# EasyEDA Pro project ProDocument_Affordable_2023-07-23.epro

# Schematic Schematic2_1
Create Date: 2023-07-10; Page Name: P1; Project Name: 39CASTIC; Schematic Name: Schematic2_1; Update Date: 2023-07-10; Add into BOM: yes; Company: 深圳嘉立创科技发展有限公司; Convert to PCB: yes; Drawed: 嘉立创EDA; Page Size: A3; Part Number: JLCPCB-001; Reviewed: 嘉立创EDA; Version: V0.1
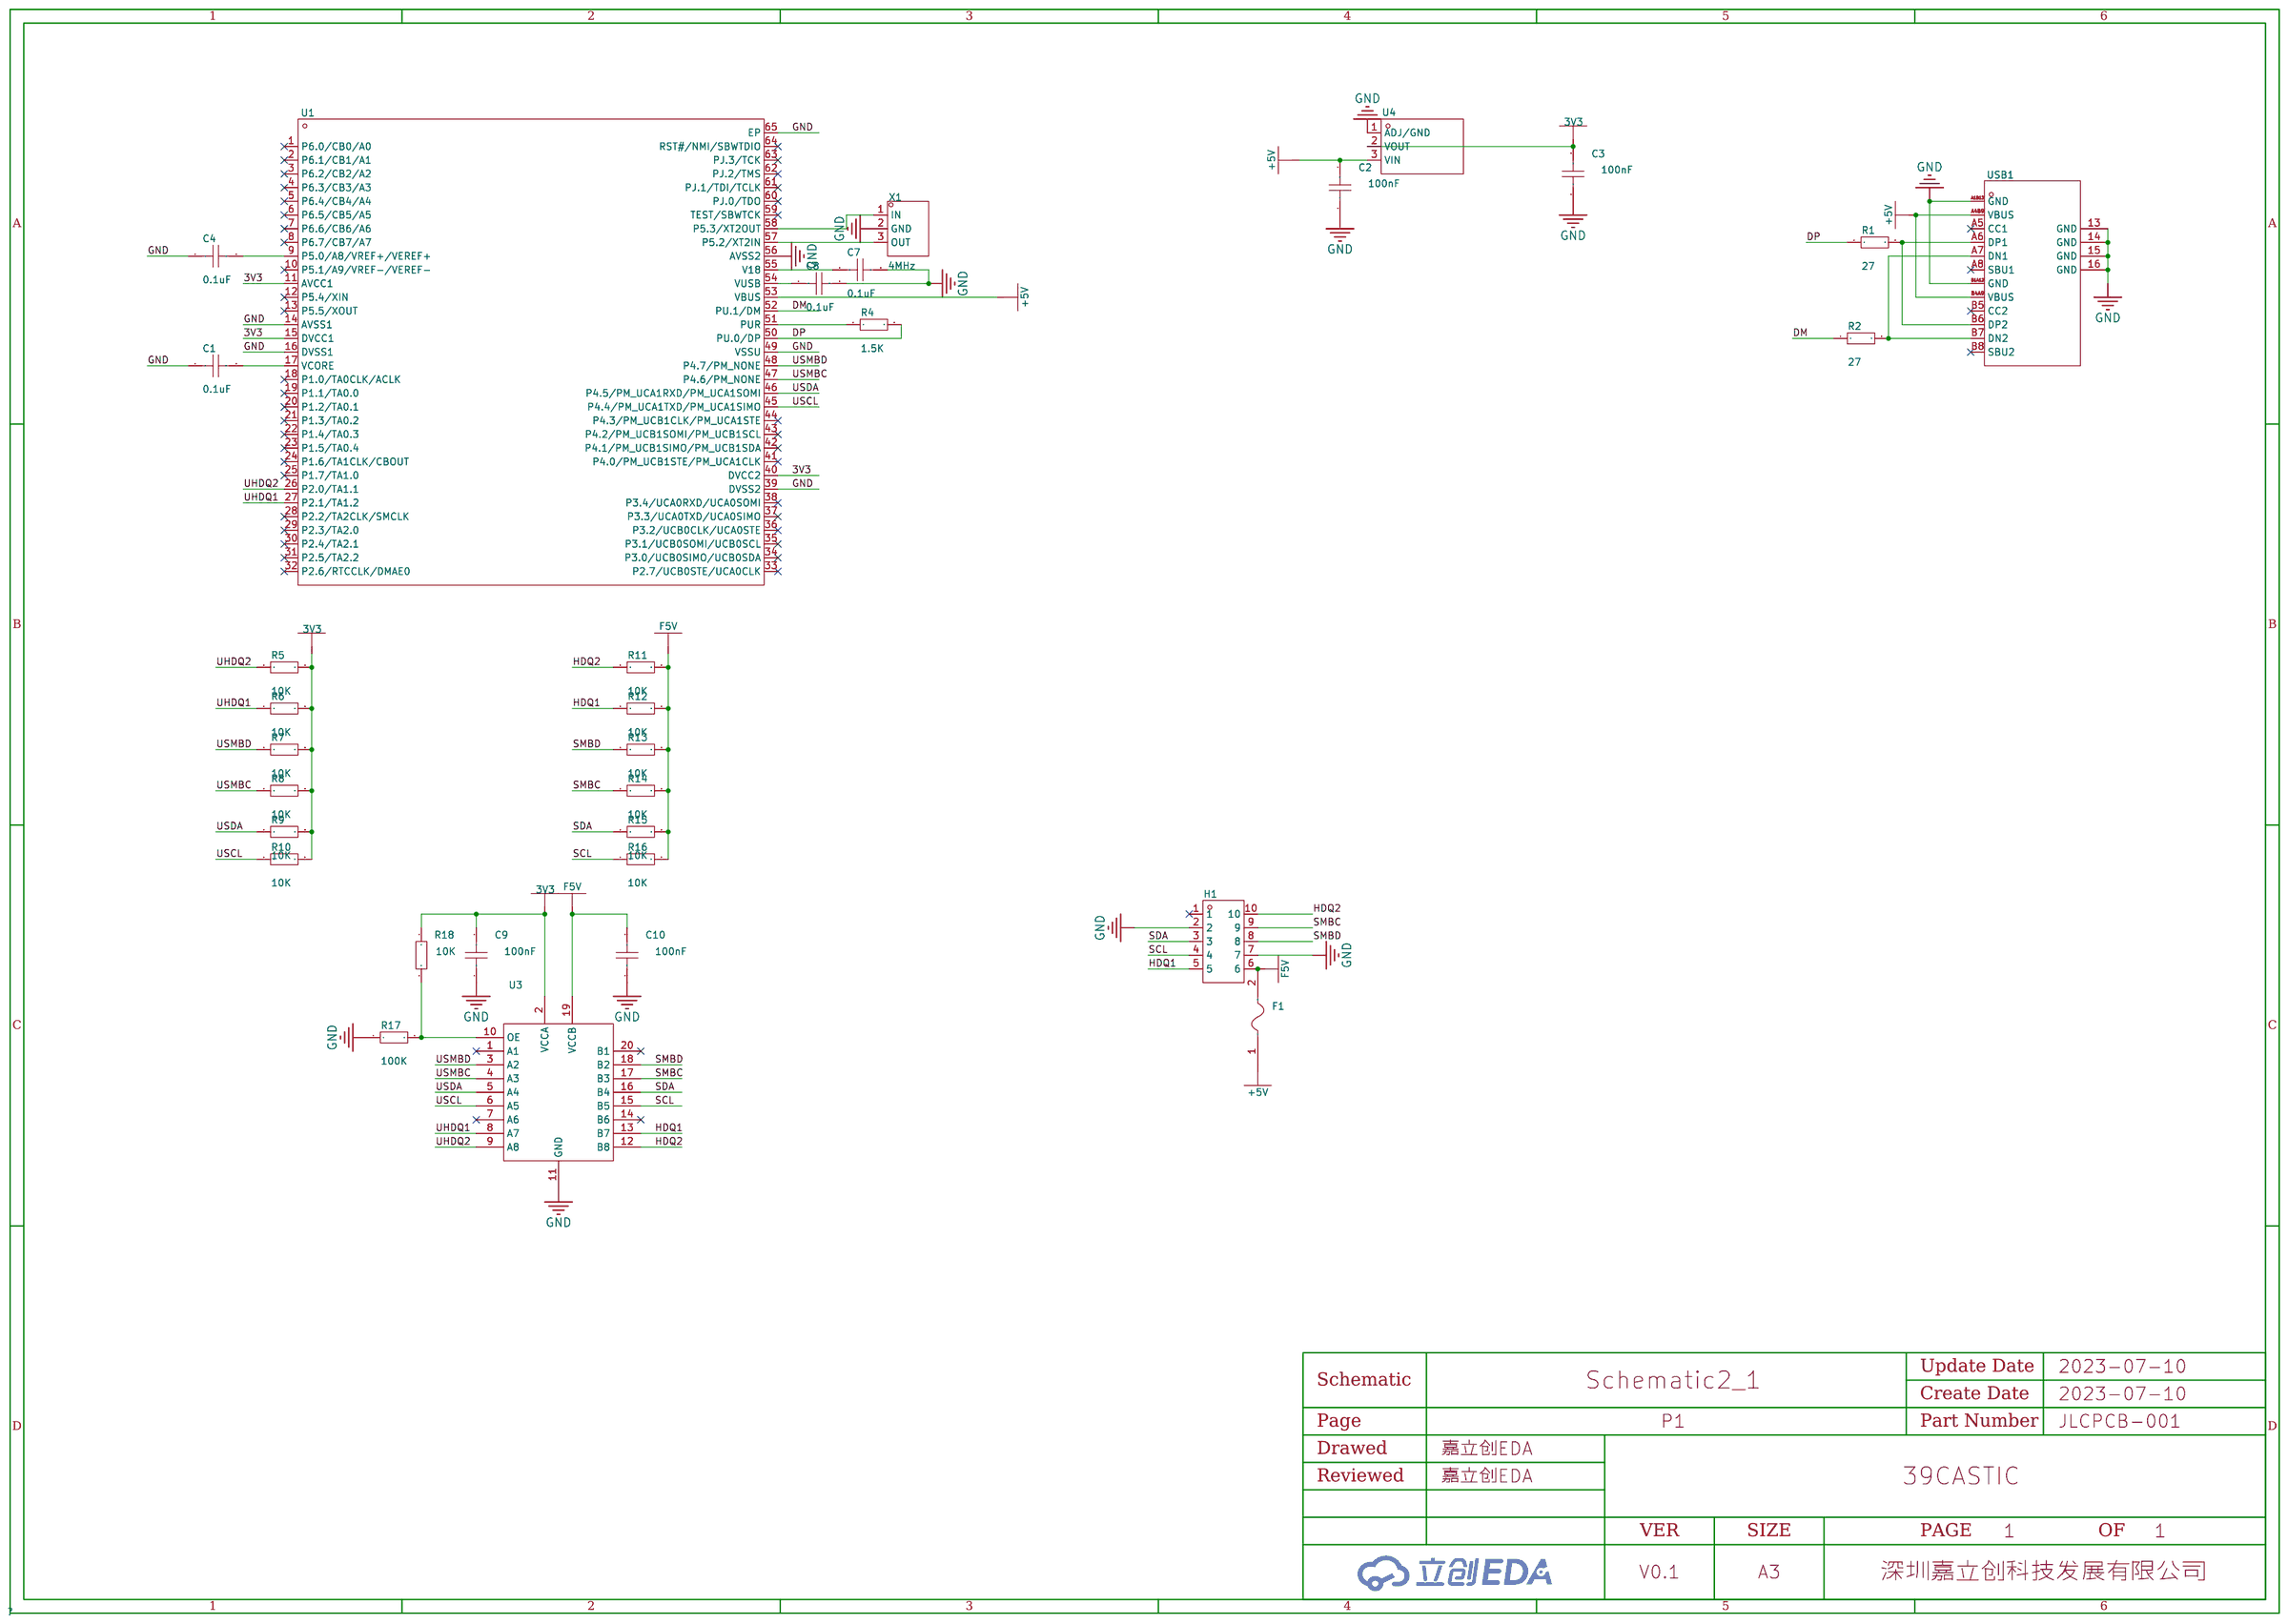
[diagram p0: schematic sheet]

## Parts
C1  0.1uF  [C0603_1]
C2  100nF  [C0603_1]
C3  100nF  [C0603_1]
C4  0.1uF  [C0603_1]
C7  0.1uF  [C0603_1]
C8  0.1uF  [C0603_1]
C9  100nF  [C0603_1]
C10  100nF  [C0603_1]
F1  -  [F0805]
H1  2*5p夹板_2.54mm  [2*5P_夹板_2.54MM]
R1  27  [R0603_1]
R2  27  [R0603_1]
R4  1.5K  [R0603_1]
R5  10K  [R0603_1]
R6  10K  [R0603_1]
R7  10K  [R0603_1]
R8  10K  [R0603_1]
R9  10K  [R0603_1]
R10  10K  [R0603_1]
R11  10K  [R0603_1]
R12  10K  [R0603_1]
R13  10K  [R0603_1]
R14  10K  [R0603_1]
R15  10K  [R0603_1]
R16  10K  [R0603_1]
R17  100K  [R0603_1]
R18  10K  [R0603_1]
U1  -  [QFN-64_L9.0-W9.0-P0.50-BL-EP4.3]
U3  -  [TSSOP-20_L6.5-W4.4-P0.65-LS6.4-BL]
U4  -  [SOT-89-3_L4.5-W2.5-P1.50-LS4.2-BR]
USB1  -  [USB-C-SMD_TYPEC-304-BCP16]
X1  4MHz  [OSC-SMD_3P-L4.5-W2.0]

## Library data of the parts
C1-C4 C7-C10 = CAP_604: 容值:100nF;精度:±10%;额定电压:50V;温度系数:X7R;; Supplier Footprint: 0603
F1 = MF-PSMF050X-2: 最大电压:6V;最大电流:40A;保持电流:500mA;跳闸电流:1A;; LCSC Part Name: 0.5A 6V 自恢复保险丝; Supplier Part: C116170; Manufacturer: BOURNS; Supplier Footprint: 0805; JLCPCB Part Class: Extended Part; Datasheet: https://atta.szlcsc.com/upload/public/pdf/source/20170704/1499151352150.pdf; Supplier: LCSC; Operating Voltage (Max): 6V; Current Rating (Max): 40A; Hold Current: 500mA; Trip Current: 1A
H1 = 2*5p夹板_2.54mm: Pin Type: IN
R1 R2 R4-R18 = Res_604: Supplier Footprint: 0603
U1 = MSP430F5528IRGCR: CPU位数:16-Bit;CPU内核:CPUXV2;主频（MAX):25MHz;工作电压:1.8V ~ 3.6V;; Supplier Part: C179685; Manufacturer: TI(德州仪器); Supplier Footprint: QFN-64_9x9x05P; JLCPCB Part Class: Extended Part; Datasheet: https://atta.szlcsc.com/upload/public/pdf/source/20180202/C179685_15175649480981336386.pdf; Supplier: LCSC; Core Size: 16-Bit; Core Processor: CPUXV2; Speed: 25MHz; Voltage - Supply (Vcc/Vdd): 1.8V ~ 3.6V; RAM Size: 10KB; Number of I/O: 47; A/D: 12x12bit; PWM: 3; I2C（SMBUS/PMBUS）: 2; USB Device: 1; USB Host/OTG: 1; Features: IrDA,LIN,SCI
U3 = TXS0108EPWR: 转换器类型:电压电平;通道类型:双向;电路数:1;每个电路通道数:8;工作电压(VCCA):1.4V~3.6V;工作电压(VCCB):1.65V~5.5V;输入信号:-;输出信号:-;输出类型:开路漏极，推挽式;数据速率:60Mbps;工作温度:-40~+85;特性:自动方向检测;; Supplier Part: C17206; Manufacturer: TI(德州仪器); Supplier Footprint: TSSOP-20; JLCPCB Part Class: Extended Part; Datasheet: https://atta.szlcsc.com/upload/public/pdf/source/20140704/1457707111315.pdf; Supplier: LCSC; Translator Type: 电压电平; Channel Type: 双向; Number of Circuits: 1; Channels per Circuit: 8; Supply Voltage (VCCA): 1.4V~3.6V; Supply Voltage (VCCB): 1.65V~5.5V; Output Type: 开路漏极，推挽式; Data Rate: 60Mbps; Operating Temperature: -40~+85; Features: 自动方向检测
U4 = AMS1117-5.0: 输出类型:-;; Supplier Part: C880753; Manufacturer: Slkor(萨科微); Supplier Footprint: SOT-89; JLCPCB Part Class: Extended Part; Datasheet: https://atta.szlcsc.com/upload/public/pdf/source/20190906/C426566_95BE246DE70C248781207323626ADB09.pdf; Supplier: LCSC
USB1 = TYPEC-304-BCP16: 连接器类型:Type-C;标准:USB 3.1;公母:母座;触点数量:16.0;端口数量:1;安装方式:卧贴;额定电流 - 电源:3A;工作温度范围:-25~+85;焊接温度(最大值):260;; Supplier Part: C720629; Manufacturer: XUNPU(讯普); Supplier Footprint: SMD; JLCPCB Part Class: Extended Part; Datasheet: https://atta.szlcsc.com/upload/public/pdf/source/20211022/DACD6552F639E9483017DE6DC0E61150.pdf; Supplier: LCSC; Connector Type: Type-C; Standard: USB 3.1; Gender: 母座; Number of Contacts: 16.0; Number of Ports: 1; Mounting Sytle: 卧贴; Current Rating - Power (Max): 3A; Operating Temperature Range: -25~+85; Welding Temperature (Max): 260
X1 = CSTCR4M00G55B-R0: 频率:4MHz;频率容差:±0.5%;内藏负载电容:39pF;谐振阻抗:60Ω;; LCSC Part Name: 4MHz ±0.5% 39pF; Supplier Part: C167451; Manufacturer: muRata(村田); Supplier Footprint: SMD4520-3P; JLCPCB Part Class: Extended Part; Datasheet: https://atta.szlcsc.com/upload/public/pdf/source/20180329/C167451_1EABA10DA012BB465BD4ADA114EBBA6C.pdf; Supplier: LCSC; Frequency Stability: ±0.15%; Frequency Tolerance: ±0.5%; Built-in Load Capacitance: 39pF; Resonant Impedance: 60Ω; Operating Temperature: -40~+125

## Nets
3V3: C3.2 C9.2 R5.2 R6.2 R7.2 R8.2 R9.2 R10.2 R18.2 U1.11(AVCC1) U1.15(DVCC1) U1.40(DVCC2) U3.2(VCCA) U4.2(VOUT)
+5V: C2.2 F1.1 U1.53(VBUS) U4.3(VIN) USB1.A4B9(VBUS) USB1.B4A9(VBUS)
GND: C1.1 C2.1 C3.1 C4.1 C7.2 C8.2 C9.1 C10.1 H1.2 H1.7 R17.1 U1.14(AVSS1) U1.16(DVSS1) U1.39(DVSS2) U1.49(VSSU) U1.56(AVSS2) U1.65(EP) U3.11(GND) U4.1(ADJ/GND) USB1.13(GND) USB1.14(GND) USB1.15(GND) USB1.16(GND) USB1.A1B12(GND) USB1.B1A12(GND) X1.2(GND)
DM: R2.1 U1.52(PU.1/DM)
DP: R1.1 R4.2 U1.50(PU.0/DP)
F5V: C10.2 F1.2 H1.6 R11.2 R12.2 R13.2 R14.2 R15.2 R16.2 U3.19(VCCB)
HDQ1: H1.5 R12.1 U3.13(B7)
HDQ2: H1.10 R11.1 U3.12(B8)
SCL: H1.4 R16.1 U3.15(B5)
SDA: H1.3 R15.1 U3.16(B4)
SMBC: H1.9 R14.1 U3.17(B3)
SMBD: H1.8 R13.1 U3.18(B2)
UHDQ1: R6.1 U1.27(P2.1/TA1.2) U3.8(A7)
UHDQ2: R5.1 U1.26(P2.0/TA1.1) U3.9(A8)
USCL: R10.1 U1.45(P4.4/PM_UCA1TXD/PM_UCA1SIMO) U3.6(A5)
USDA: R9.1 U1.46(P4.5/PM_UCA1RXD/PM_UCA1SOMI) U3.5(A4)
USMBC: R8.1 U1.47(P4.6/PM_NONE) U3.4(A3)
USMBD: R7.1 U1.48(P4.7/PM_NONE) U3.3(A2)
$1N2107: U1.58(P5.3/XT2OUT) X1.1(IN)
$1N2114: U1.57(P5.2/XT2IN) X1.3(OUT)
$1N2457: R1.2 USB1.A6(DP1) USB1.B6(DP2)
$1N2458: R2.2 USB1.A7(DN1) USB1.B7(DN2)
$1N2994: C1.2 U1.17(VCORE)
$1N5348: C7.1 U1.55(V18)
$1N5368: C8.1 U1.54(VUSB)
$1N5675: R4.1 U1.51(PUR)
$1N11039: R17.2 R18.1 U3.10(OE)
$1N25556: C4.2 U1.9(P5.0/A8/VREF+/VEREF+)

Not connected (* = marked no-connect by the designer): H1 1*; U1 1(P6.0/CB0/A0)* 2(P6.1/CB1/A1)* 3(P6.2/CB2/A2)* 4(P6.3/CB3/A3)* 5(P6.4/CB4/A4)* 6(P6.5/CB5/A5)* 7(P6.6/CB6/A6)* 8(P6.7/CB7/A7)* 10(P5.1/A9/VREF-/VEREF-)* 12(P5.4/XIN)* 13(P5.5/XOUT)* 18(P1.0/TA0CLK/ACLK)* 19(P1.1/TA0.0)* 20(P1.2/TA0.1)* 21(P1.3/TA0.2)* 22(P1.4/TA0.3)* 23(P1.5/TA0.4)* 24(P1.6/TA1CLK/CBOUT)* 25(P1.7/TA1.0)* 28(P2.2/TA2CLK/SMCLK)* 29(P2.3/TA2.0)* 30(P2.4/TA2.1)* 31(P2.5/TA2.2)* 32(P2.6/RTCCLK/DMAE0)* 33(P2.7/UCB0STE/UCA0CLK)* 34(P3.0/UCB0SIMO/UCB0SDA)* 35(P3.1/UCB0SOMI/UCB0SCL)* 36(P3.2/UCB0CLK/UCA0STE)* 37(P3.3/UCA0TXD/UCA0SIMO)* 38(P3.4/UCA0RXD/UCA0SOMI)* 41(P4.0/PM_UCB1STE/PM_UCA1CLK)* 42(P4.1/PM_UCB1SIMO/PM_UCB1SDA)* 43(P4.2/PM_UCB1SOMI/PM_UCB1SCL)* 44(P4.3/PM_UCB1CLK/PM_UCA1STE)* 59(TEST/SBWTCK)* 60(PJ.0/TDO)* 61(PJ.1/TDI/TCLK)* 62(PJ.2/TMS)* 63(PJ.3/TCK)* 64(RST#/NMI/SBWTDIO)*; U3 1(A1)* 7(A6)* 14(B6)* 20(B1)*; USB1 A5(CC1)* A8(SBU1)* B5(CC2)* B8(SBU2)*

# Board PCB2_1
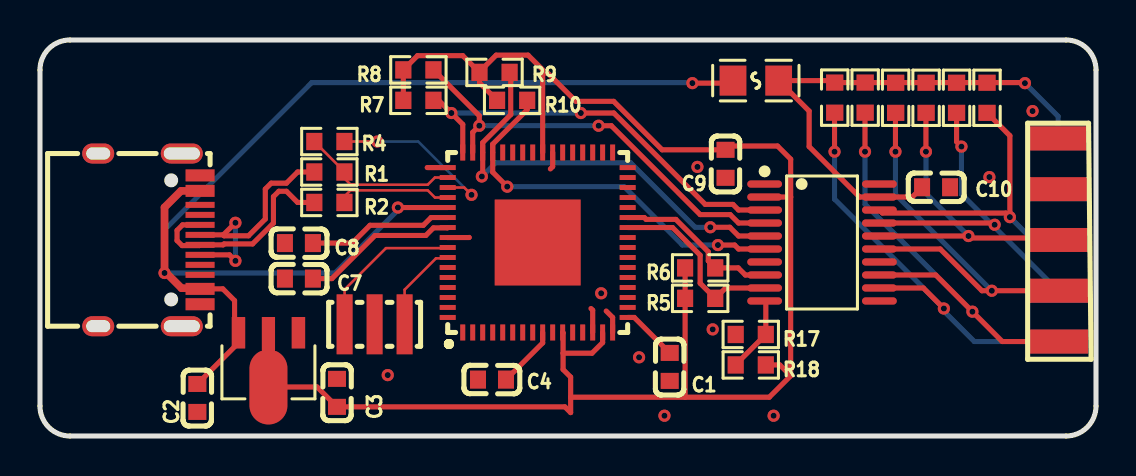
[diagram p1: board, top side]
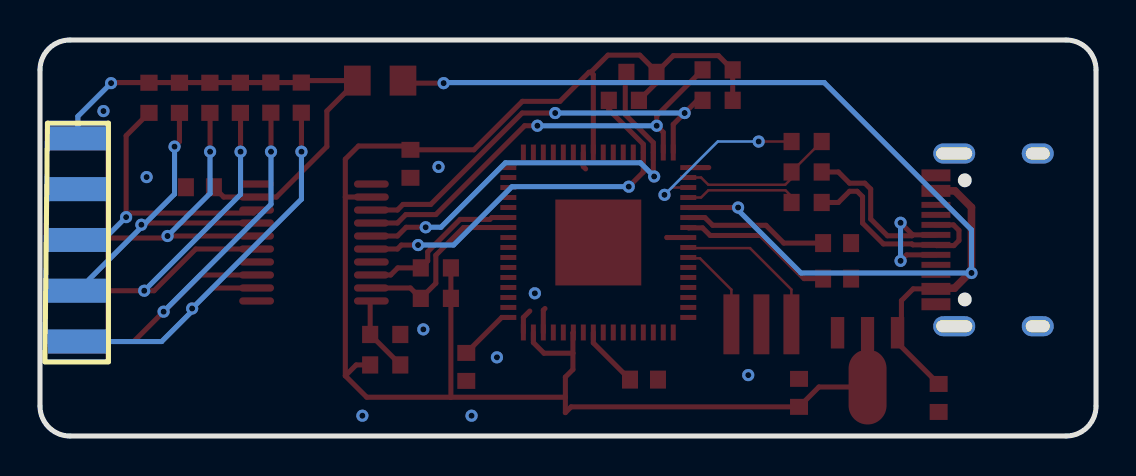
[diagram p2: board, bottom side, seen from below]

Outline 52.83 x 19.81 mm; copper layers: Top Layer, Bottom Layer. Coordinates in mm from the lower left corner of the outline.
Outline path: 0,18.31 0,1.5 arc(0.44,0.44) 1.5,0 51.33,0 arc(52.39,0.44) 52.83,1.5 52.83,18.31 arc(52.39,19.37) 51.33,19.81 1.5,19.81 arc(0.44,19.37) 0,18.31
Stack: Top Layer 0.035mm / Dielectric1 1.51mm FR4 er 4.5 / Bottom Layer 0.035mm

## Design rules (mm)
net DM: DP1
net DP: DP1
net $1N2457: DP2
net $1N2458: DP2
template: User Custom Config
spacing safeClearance (default): track to track 0.152, other pairs 0.152 to 0.3
track width trackWidth (default): min 0.127, default 0.254, max 2.54
differential pair differentialPair (default): width min 0.127, default 0.254, max 2.54; gap min 0.152, default 0.152
via viaSize (default): diameter min 0.5, default 0.61, max 10; hole min 0.3, default 0.305, max 5.999

## Placement (name value [footprint] x y rotation side)
C1  0.1uF  [C0603_1]  31.5 3.46 90 top
C2  100nF  [C0603_1]  7.87 1.91 90 top
C3  100nF  [C0603_1]  14.86 2.16 270 top
C4  0.1uF  [C0603_1]  22.61 2.82 0 top
C7  0.1uF  [C0603_1]  12.95 7.87 180 top
C8  0.1uF  [C0603_1]  12.95 9.65 180 top
C9  100nF  [C0603_1]  34.3 13.62 90 top
C10  100nF  [C0603_1]  44.83 12.45 180 top
F1  -  [F0805]  35.81 17.78 0 top
H1  2*5p夹板_2.54mm  [2*5P_夹板_2.54MM]  50.68 9.17 0 top
R1  27  [R0603_1]  14.48 13.21 180 top
R2  27  [R0603_1]  14.48 11.68 180 top
R4  1.5K  [R0603_1]  14.48 14.73 180 top
R5  10K  [R0603_1]  33.03 6.89 180 top
R6  10K  [R0603_1]  33.03 8.41 180 top
R7  10K  [R0603_1]  18.93 16.79 180 top
R8  10K  [R0603_1]  18.93 18.32 180 top
R9  10K  [R0603_1]  22.74 18.19 180 top
R10  10K  [R0603_1]  23.62 16.79 180 top
R11  10K  [R0603_1]  39.76 16.93 90 top
R12  10K  [R0603_1]  41.28 16.93 90 top
R13  10K  [R0603_1]  47.38 16.92 90 top
R14  10K  [R0603_1]  45.86 16.92 90 top
R15  10K  [R0603_1]  44.33 16.92 90 top
R16  10K  [R0603_1]  42.81 16.92 90 top
R17  100K  [R0603_1]  35.56 5.08 0 top
R18  10K  [R0603_1]  35.56 3.56 0 top
U1  -  [QFN-64_L9.0-W9.0-P0.50-BL-EP4.3]  24.9 9.68 0 top
U3  -  [TSSOP-20_L6.5-W4.4-P0.65-LS6.4-BL]  39.12 9.68 270 top
U4  -  [SOT-89-3_L4.5-W2.5-P1.50-LS4.2-BR]  11.43 3.81 90 top
USB1  -  [USB-C-SMD_TYPEC-304-BCP16]  5.46 9.81 270 top
X1  4MHz  [OSC-SMD_3P-L4.5-W2.0]  16.74 5.59 180 top

## Footprints (pads in the part's own frame, mm; a bottom-side part is the same pattern mirrored in y, then rotated)
2*5P_夹板_2.54MM
  rect 2.999x1.199 smd: 1(0.254,5.715) 2(0.254,3.175) 3(0.254,0.635) 4(0.254,-1.905) 5(0.254,-4.445)
  rect 2.999x1.199 smd far side: 6(0.254,5.715) 7(0.254,3.175) 8(0.254,0.635) 9(0.254,-1.905) 10(0.254,-4.445)
C0603_1
  rect 0.8x0.9 smd: 1(-0.7,0) 2(0.7,0)
F0805
  rect 1.335x1.5 smd: 1(-1.143,0) 2(1.143,0)
OSC-SMD_3P-L4.5-W2.0
  rect 0.8x2.999 smd: 1(-1.501,0) 2(0,0) 3(1.501,0)
QFN-64_L9.0-W9.0-P0.50-BL-EP4.3
  rect 0.249x0.8 smd: 1(-3.749,-4.501) 2(-3.251,-4.501) 3(-2.751,-4.501) 4(-2.251,-4.501) 5(-1.75,-4.501) 6(-1.25,-4.501) 7(-0.75,-4.501) 8(-0.249,-4.501) 9(0.249,-4.501) 10(0.75,-4.501) 11(1.25,-4.501) 12(1.75,-4.501) 13(2.251,-4.501) 14(2.751,-4.501) 15(3.248,-4.501) 16(3.749,-4.501) 33(3.749,4.501) 34(3.248,4.501) 35(2.751,4.501) 36(2.251,4.501) 37(1.75,4.501) 38(1.25,4.501) 39(0.75,4.501) 40(0.249,4.501) 41(-0.249,4.501) 42(-0.75,4.501) 43(-1.25,4.501) 44(-1.75,4.501) 45(-2.251,4.501) 46(-2.751,4.501) 47(-3.251,4.501) 48(-3.749,4.501)
  rect 0.8x0.249 smd: 17(4.501,-3.749) 18(4.501,-3.248) 19(4.501,-2.751) 20(4.501,-2.251) 21(4.501,-1.75) 22(4.501,-1.25) 23(4.501,-0.75) 24(4.501,-0.249) 25(4.501,0.249) 26(4.501,0.75) 27(4.501,1.25) 28(4.501,1.75) 29(4.501,2.251) 30(4.501,2.751) 31(4.501,3.251) 32(4.501,3.749) 49(-4.501,3.749) 50(-4.501,3.251) 51(-4.501,2.751) 52(-4.501,2.251) 53(-4.501,1.75) 54(-4.501,1.25) 55(-4.501,0.75) 56(-4.501,0.249) 57(-4.501,-0.249) 58(-4.501,-0.75) 59(-4.501,-1.25) 60(-4.501,-1.75) 61(-4.501,-2.251) 62(-4.501,-2.751) 63(-4.501,-3.248) 64(-4.501,-3.749)
  rect 4.3x4.3 smd: 65(0,0)
R0603_1
  rect 0.806x0.864 smd: 1(-0.753,0) 2(0.753,0)
SOT-89-3_L4.5-W2.5-P1.50-LS4.2-BR
  rect 1.575x0.672 smd: 1(1.356,-1.5) 3(1.356,1.5)
  custom 5.377x1.9 smd: 2(-1.356,0)
TSSOP-20_L6.5-W4.4-P0.65-LS6.4-BL
  oval 0.364x1.742 smd: 1(-2.925,-2.871) 2(-2.275,-2.871) 3(-1.625,-2.871) 4(-0.975,-2.871) 5(-0.325,-2.871) 6(0.325,-2.871) 7(0.975,-2.871) 8(1.625,-2.871) 9(2.275,-2.871) 10(2.925,-2.871) 11(2.925,2.871) 12(2.275,2.871) 13(1.625,2.871) 14(0.975,2.871) 15(0.325,2.871) 16(-0.325,2.871) 17(-0.975,2.871) 18(-1.625,2.871) 19(-2.275,2.871) 20(-2.925,2.871)
USB-C-SMD_TYPEC-304-BCP16
  oval 1.001x2.1 hole 0.6x1.801: 13(-4.321,1.633) 14(4.321,1.633)
  oval 1.001x1.6 hole 0.6x1.199: 15(-4.321,-2.547) 16(4.321,-2.547)
  rect 0.6x1.45 smd: A1B12(-3.226,2.547) A4B9(-2.451,2.547) B1A12(3.22,2.547) B4A9(2.451,2.547)
  rect 0.299x1.45 smd: A5(-1.25,2.547) A6(-0.249,2.547) A7(0.249,2.547) A8(1.25,2.547) B5(1.75,2.547) B6(0.75,2.547) B7(-0.75,2.547) B8(-1.75,2.547)

## Nets
As in the schematic.

Pads without a net: H1 1; U1 1 2 3 4 5 6 7 8 10 12 13 18 19 20 21 22 23 24 25 28 29 30 31 32 33 34 35 36 37 38 41 42 43 44 59 60 61 62 63 64; U3 1 7 14 20; USB1 A5 A8 B5 B8

## Via types
v1: diameter 0.61, hole 0.305, Top Layer to Bottom Layer, 36 vias

## Routing (per net, layer and track width the routed paths; a pad name or vN(x,y) marks a point on that pad's centre or on a via; arc(x,y) is an arc through that point)
3V3: length 83.9
  Top Layer w0.254: 25.27,18.2 25.15,18.07 25.15,14.18 ; 25.27,18.2 24.42,19.05 22.82,19.05 21.99,18.22 R9.2 ; 25.27,18.2 25.36,18.2 26.82,16.74 28.7,16.74 31.12,14.32 C9.2 ; 26.17,4.14 26.17,5.16 U1.11 ; 26.17,4.14 27.62,4.14 28.15,4.67 U1.15 ; 26.17,4.14 26.17,3.33 26.55,2.95 26.55,1.94 ; 32.28,1.94 32.27,1.95 R5.2 R6.2 ; 32.28,1.94 36.48,1.94 37.56,3.01 ; 32.28,1.94 26.55,1.94 ; R9.2 21.99,17.67 R10.2 ; R9.2 21.15,19.03 18.89,19.03 R8.2 R7.2 ; 26.55,1.94 26.55,1.17 26.26,1.46 C3.2 13.86,2.45 U4.2 ; 37.56,11.96 37.56,13.85 36.9,14.51 34.49,14.51 ; 37.56,11.96 37.56,3.01 ; 37.56,11.96 U3.2 ; 37.56,3.01 37.01,3.56 36.31,3.56
+5V: length 63.9
  Top Layer w0.254: C2.2 9.93,4.66 U4.3 9.74,5.36 9.74,6.77 9.15,7.36 USB1.B4A9 7.98,7.39 ; F1.1 34.54,17.65 v1(32.64,17.65) ; v1(17.91,11.43) U1.53
  Top Layer w0.381: USB1.A4B9 7.06,12.26 6.23,11.44 v1(6.23,8.16) 6.32,8.16 7.08,7.39 7.98,7.39
  Bottom Layer w0.254: v1(32.64,17.65) 32.61,17.68 13.6,17.68 6.23,10.32 v1(6.23,8.16) 14.76,8.16 17.91,11.3 v1(17.91,11.43)
GND: length 5.4
  Top Layer w0.254: 27.57,6.38 27.65,6.29 U1.14 ; 19.37,13.43 U1.49 ; 28.65,5.18 28.65,5.93 28.33,6.25 ; U1.56 21.47,9.93 21.47,9.93 ; 25.54,13.36 25.65,13.48 U1.39
  vias: v1(17.4,3.05) v1(28.08,7.14) v1(29.97,3.94) v1(31.24,1.02) v1(32.89,13.46) v1(33.65,5.33) v1(36.7,1.02) v1(47.5,12.95) v1(49.66,16.26)
DM: length 5.7
  Top Layer w0.127: U1.52 19.76,11.93 19.4,12.29 15.53,12.29 15.23,11.99 R2.1
DP: length 7.9
  Top Layer w0.127: R4.2 15.23,13.23 R1.1 15.23,12.89 15.55,12.57 19.4,12.57 19.76,12.93 U1.50
F5V: length 26.7
  Top Layer w0.254: C10.2 43.64,11.96 U3.19 41,11.96 38.48,14.48 38.48,16.26 F1.2 39.66,17.78 R11.2 R12.2 49.25,17.68 v1(49.28,17.65)
  Bottom Layer w0.254: H1.6 50.94,15.99 v1(49.28,17.65)
HDQ1: length 22.5
  Top Layer w0.254: v1(41.27,14.22) 41.27,16.17 41.28,16.17 ; U3.13 44.81,8.06 v1(46.65,6.22) 48.14,4.73 H1.5
  Bottom Layer w0.254: v1(41.27,14.22) 41.27,11.59 v1(46.65,6.22)
HDQ2: length 22.4
  Top Layer w0.254: v1(45.22,6.38) 44.19,7.41 U3.12 ; 39.76,16.17 39.75,16.17 v1(39.75,14.22)
  Bottom Layer w0.254: v1(39.75,14.22) 39.75,11.85 v1(45.22,6.38) 45.09,6.38 46.74,4.73 H1.10
SCL: length 20.7
  Top Layer w0.254: U3.15 45.04,9.36 47.13,7.27 v1(47.62,7.27) H1.4 ; R16.1 42.8,16.16 v1(42.8,14.22)
  Bottom Layer w0.254: v1(42.8,14.22) 42.8,12.09 v1(47.62,7.27)
SDA: length 16.1
  Top Layer w0.254: v1(44.32,14.22) 44.32,16.16 R15.1 ; U3.16 v1(46.45,10.01) 46.55,9.91 50.84,9.91 H1.3
  Bottom Layer w0.254: v1(44.32,14.22) 44.32,12.13 v1(46.45,10.01)
SMBC: length 16.9
  Top Layer w0.254: v1(46.1,14.48) 45.86,14.72 R14.1 ; v1(47.76,10.57) 47.67,10.66 U3.17
  Bottom Layer w0.254: 47.76,10.44 46.1,12.1 v1(46.1,14.48) ; 47.76,10.44 v1(47.76,10.57) ; 47.76,10.44 H1.9
SMBD: length 15.2
  Top Layer w0.254: R13.1 48.52,15.02 v1(48.52,10.95) 48.32,11.15 42.15,11.15 U3.18
  Bottom Layer w0.254: v1(48.52,10.95) 49.67,9.81 H1.8
UHDQ1: length 8.3
  Top Layer w0.254: U3.8 35.29,8.06 34.93,8.41 R6.1 33.43,8.76 33.43,9.21 31.81,10.84 30.33,10.84 30.23,10.93 U1.27
UHDQ2: length 9.4
  Top Layer w0.254: U1.26 31.64,10.43 33.03,9.05 33.03,7.64 R5.1 34.3,7.41 U3.9
USCL: length 19.5
  Top Layer w0.254: U3.6 34.95,9.36 34.75,9.55 v1(33.92,9.55) ; R10.1 24.37,16.33 22.65,14.6 U1.45 22.65,13.2 v1(23.38,12.47)
  Bottom Layer w0.254: v1(33.92,9.55) 32.14,9.55 29.22,12.47 v1(23.38,12.47)
USDA: length 21.8
  Top Layer w0.254: v1(22.11,12.98) 22.15,13.03 22.15,14.68 23.55,16.08 23.55,18.13 R9.1 ; v1(33.54,10.44) 34.51,10.44 34.95,10.01 U3.5
  Bottom Layer w0.254: v1(33.54,10.44) 32.77,10.44 29.55,13.67 22.79,13.67 v1(22.11,12.98)
USMBC: length 21.5
  Top Layer w0.254: v1(27.95,15.52) 28.58,15.52 33.03,11.08 34.53,11.08 34.95,10.66 U3.4 ; R8.1 21.98,16.02 v1(21.98,15.52) 21.65,15.19 21.65,14.18
  Bottom Layer w0.254: v1(21.98,15.52) v1(27.95,15.52)
USMBD: length 21.1
  Top Layer w0.254: R7.1 19.95,16.79 v1(20.58,16.16) 21.15,15.59 U1.48 ; v1(27.06,16.16) 28.71,16.16 33.28,11.59 34.67,11.59 34.95,11.31 U3.3
  Bottom Layer w0.254: v1(20.58,16.16) v1(27.06,16.16)
$1N2107: length 4.6
  Top Layer w0.127: U1.58 20.36,8.89 19.81,8.89 18.24,7.32 X1.1
$1N2114: length 7.8
  Top Layer w0.127: X1.3 15.24,7.33 17.31,9.4 20.37,9.4 U1.57
$1N2457: length 12.6
  Top Layer w0.254: v1(9.78,10.67) 9.17,10.06 9.17,10.06 ; 9.17,10.06 9.21,10.02 10.43,10.02 11.27,10.86 11.27,12.35 11.57,12.65 12.33,12.65 12.89,13.21 R1.2 ; 9.17,10.06 USB1.A6 ; USB1.B6 9.48,9.06 v1(9.78,8.76)
  Bottom Layer w0.254: v1(9.78,8.76) v1(9.78,10.67)
$1N2458: length 10.9
  Top Layer w0.254: R2.2 12.89,11.68 12.33,12.24 11.95,12.24 11.68,11.97 11.68,10.65 10.64,9.61 9.21,9.61 9.17,9.56 USB1.A7 7.97,9.53 7.11,9.53 6.86,9.78 6.86,10.29 7.13,10.56 USB1.B7
$1N2994: length 2.8
  Top Layer w0.254: U1.17 29.73,5.93 C1.2
$1N5348: length 8.1
  Top Layer w0.254: 13.4,7.87 14.61,7.87 16.76,10.03 19.3,10.03 19.68,10.41 20.38,10.41 U1.55
$1N5368: length 7.5
  Top Layer w0.254: 13.4,9.65 15.62,9.65 16.51,10.54 19.18,10.54 19.57,10.93 U1.54
$1N5675: length 8.8
  Top Layer w0.127: v1(21.59,12.06) 21.22,12.43 U1.51 ; R4.1 16.76,14.73
  Bottom Layer w0.127: 16.76,14.73 18.92,14.73 v1(21.59,12.06)
  vias: v1(16.88,14.73)
$1N11039: length 3.8
  Top Layer w0.254: R18.1 34.81,3.57 36.31,5.08 36.31,6.7 U3.10
$1N25556: length 3.1
  Top Layer w0.254: C4.2 25.15,4.66 25.15,5.18

## Copper pours and planes (outline as drawn; the poured copper is in the pictures)
GND on Top Layer: -2.66,21.62 54.49,21.62 54.49,-2.51 -2.66,-2.51
GND on Bottom Layer: -4.18,23.52 55,23.52 55,-6.58 -4.18,-6.58
